# EAGLE design power (EAGLE 9.5.1)
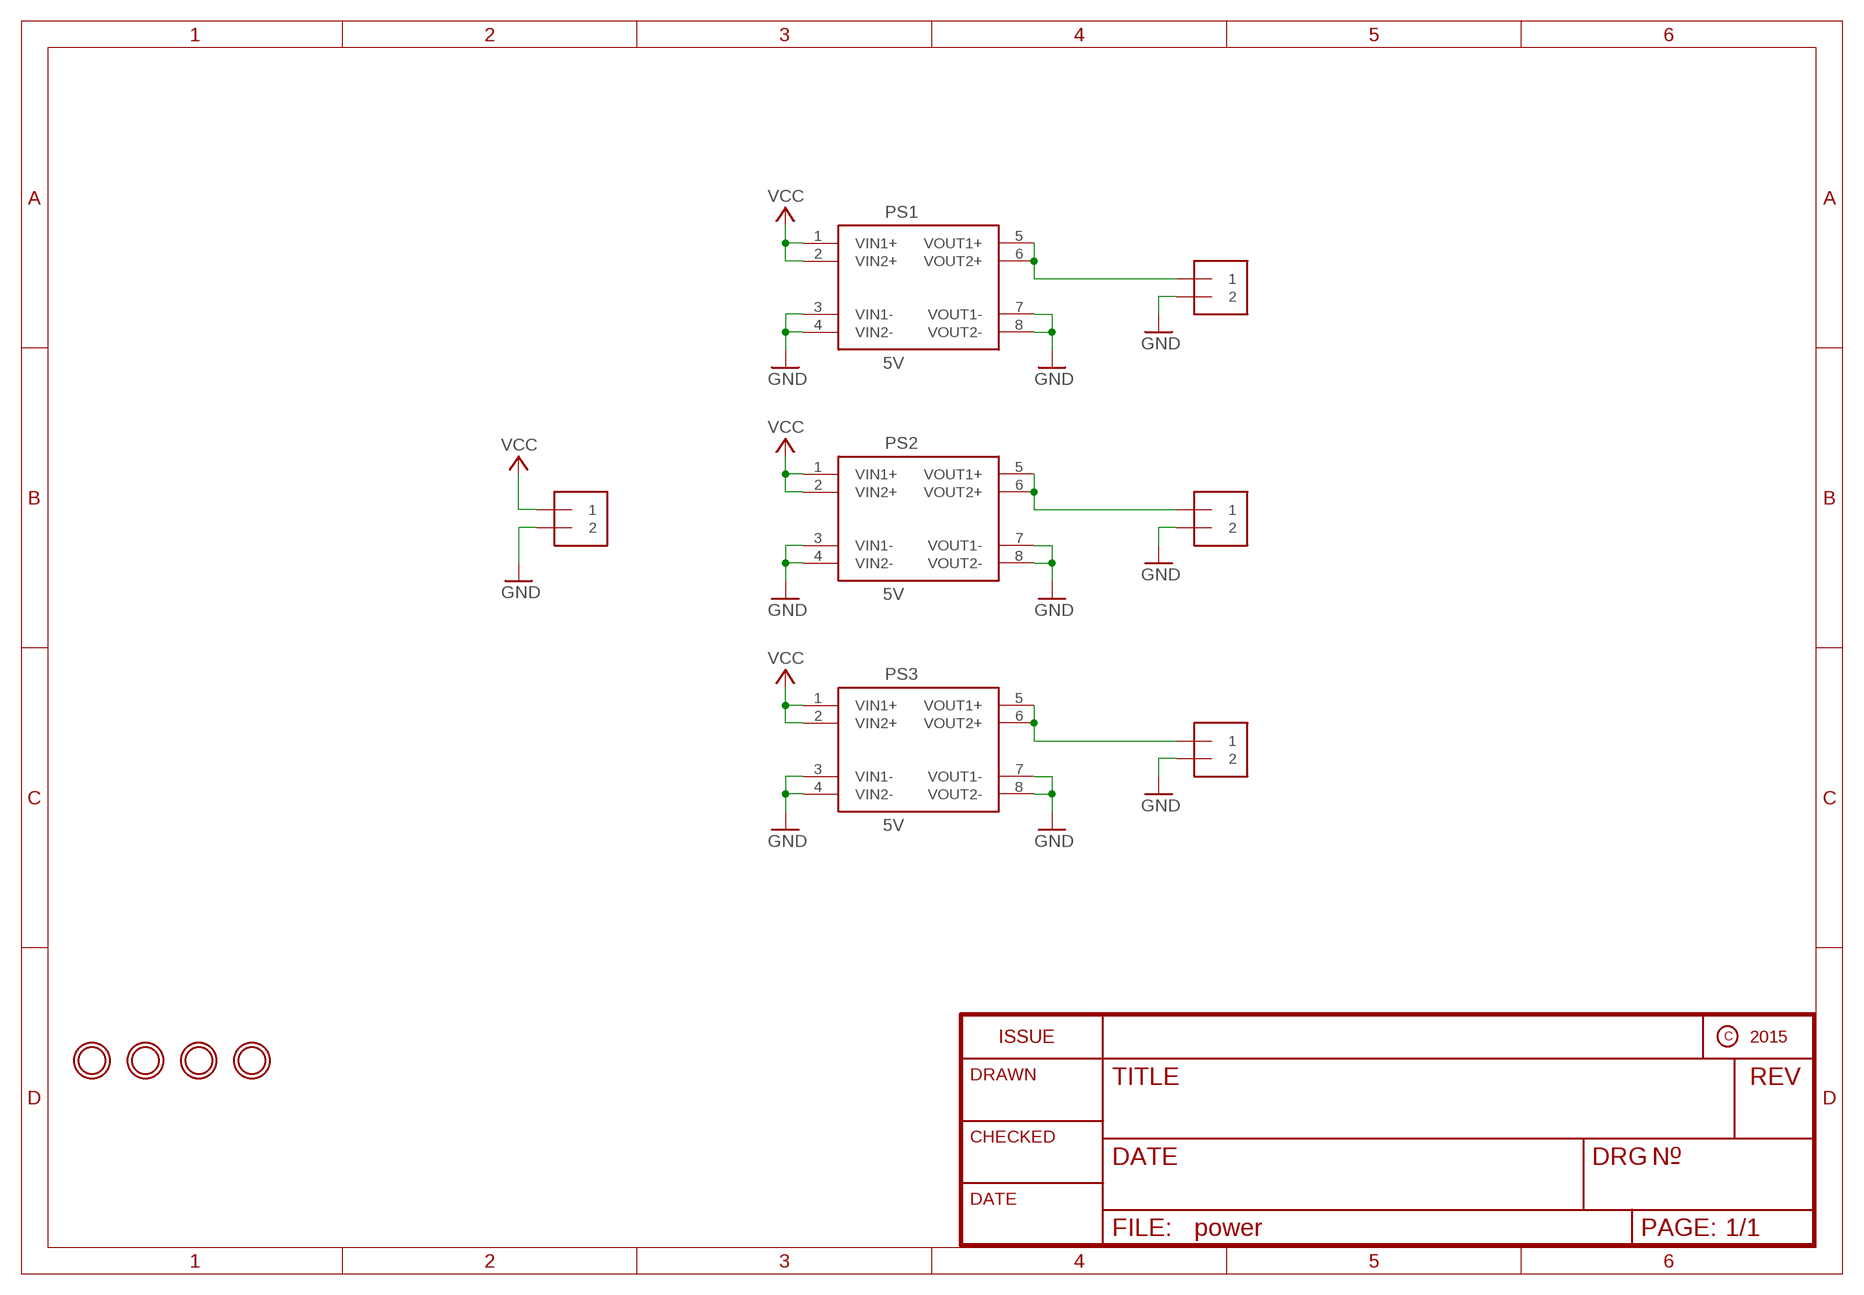
[diagram p0: schematic, sheet 1]

## Parts
J1  1X2-3.5MM  [1X2-3.5MM]
J2  1X2-3.5MM  [1X2-3.5MM]
J3  1X2-3.5MM  [1X2-3.5MM]
J4  1X2-3.5MM  [1X2-3.5MM]
PS1  5V  K8801MODULE  [K8801]
PS2  5V  K8801MODULE  [K8801]
PS3  5V  K8801MODULE  [K8801]
U$1  MICROBUILDER_MOUNTINGHOLE2.5  [MICROBUILDER_MOUNTINGHOLE_2.5_PLATED]
U$2  MICROBUILDER_MOUNTINGHOLE2.5  [MICROBUILDER_MOUNTINGHOLE_2.5_PLATED]
U$3  MICROBUILDER_MOUNTINGHOLE2.5  [MICROBUILDER_MOUNTINGHOLE_2.5_PLATED]
U$4  MICROBUILDER_MOUNTINGHOLE2.5  [MICROBUILDER_MOUNTINGHOLE_2.5_PLATED]

## Nets
GND: J1.2 J2.2 J3.2 J4.2 PS1.3(VIN1-) PS1.4(VIN2-) PS1.7(VOUT1-) PS1.8(VOUT2-) PS2.3(VIN1-) PS2.4(VIN2-) PS2.7(VOUT1-) PS2.8(VOUT2-) PS3.3(VIN1-) PS3.4(VIN2-) PS3.7(VOUT1-) PS3.8(VOUT2-)
N$3: J3.1 PS2.5(VOUT1+) PS2.6(VOUT2+)
N$5: J4.1 PS3.5(VOUT1+) PS3.6(VOUT2+)
N$7: J2.1 PS1.5(VOUT1+) PS1.6(VOUT2+)
VCC: J1.1 PS1.1(VIN1+) PS1.2(VIN2+) PS2.1(VIN1+) PS2.2(VIN2+) PS3.1(VIN1+) PS3.2(VIN2+)

## Library data of the parts
J1-J4 = adafruit:1X2: 3.5mm Terminal block http://www.ladyada.net/library/pcb/eaglelibrary.html
PS1-PS3 = sanisimov:K8801: 7V-28V to 5V DC-DC Step Down Power Supply Module Voltage Buck Converter 3A Power Supply Board Input voltage:DC 7V-28V Output valtage:DC 5V Output current:3A. max(2A for long time) Working frequency:570KHz Size:22*17.8*5mm
U$1-U$4 = Adafruit DRV8871:MICROBUILDER_MOUNTINGHOLE: Mounting Hole For #2 screws (0.086"/2.18mm width, 0.094"/2.4mm hole) use 2.5mm; BOM: EXCLUDE

## Net classes
1 GND: clearance 2.54 mm

## Board
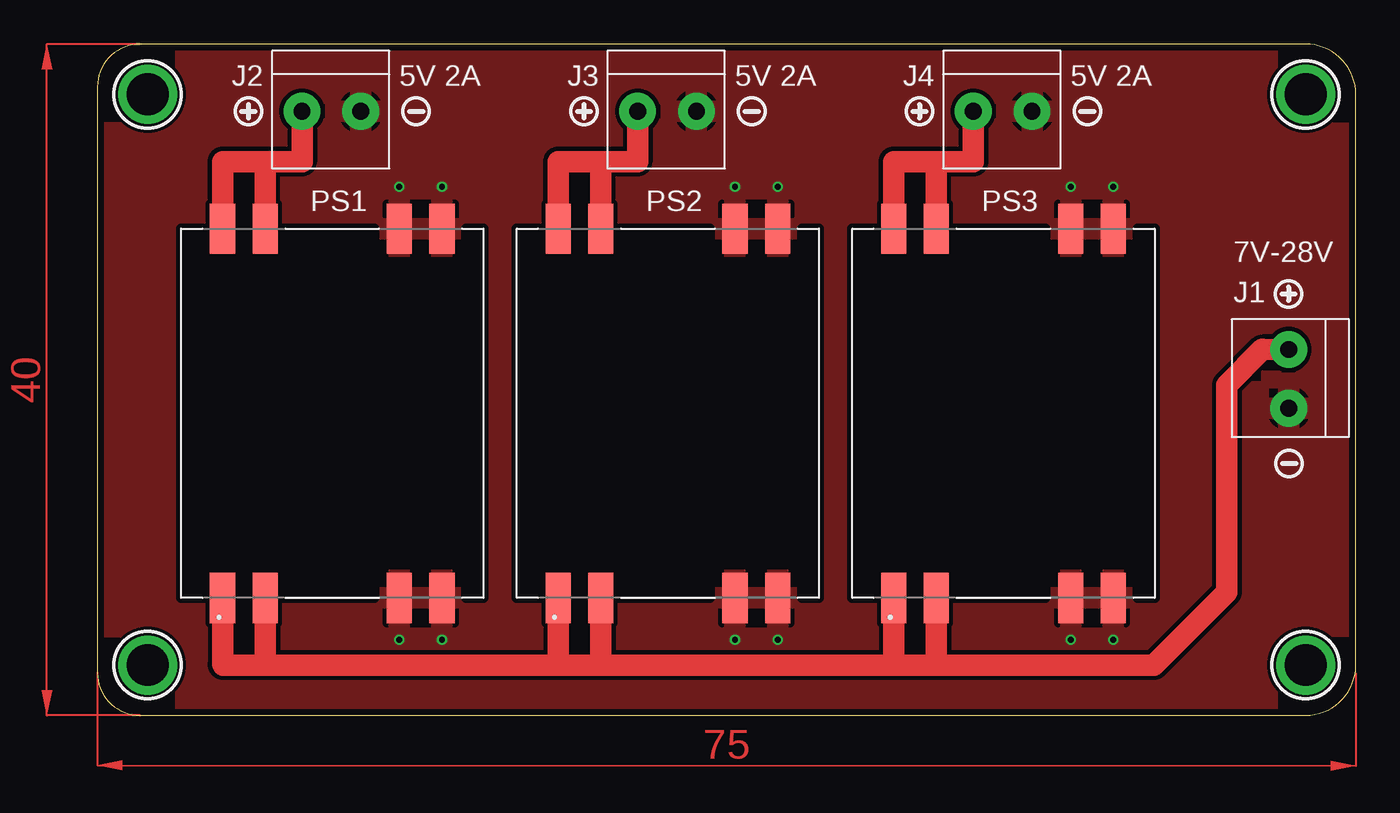
[diagram p1: board, top side]
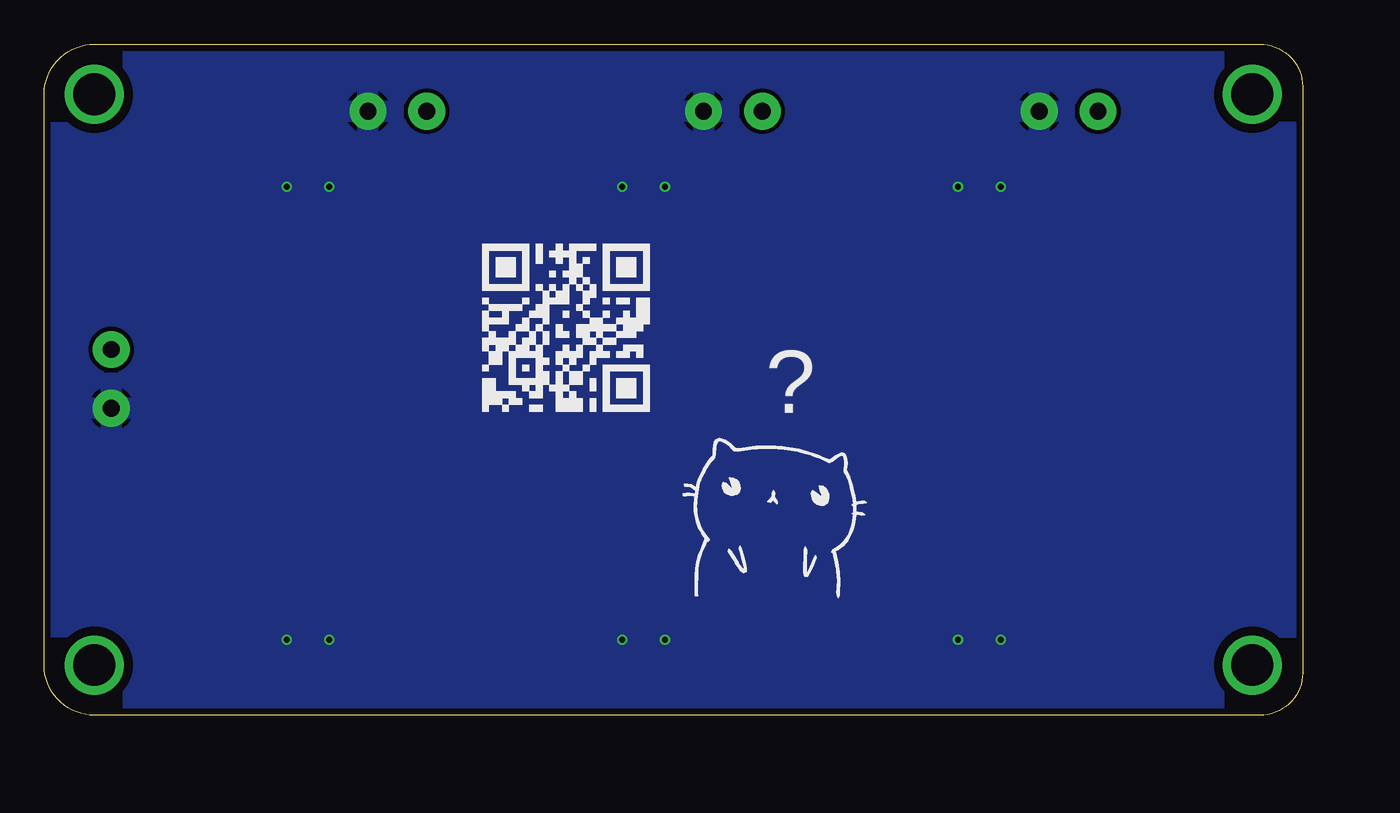
[diagram p2: board, bottom side, seen from below]

Size 75 x 40 mm. Coordinates in mm from the lower left corner, seen from the top.
Outline: 75,3 75,37 arc90 72,40 2.54,40 arc90 0,37.46 0,2.54 arc90 2.54,0 72,0 arc90 75,3
Copper layers (1*16): Top 0.035559375mm / dielectric 1.6mm / Bottom 0.035559375mm
Design rules "oshpark-2layer": minimum track width 6mil, minimum drill 10mil, track to track 6mil, track to pad 6mil, pad to pad 6mil, via to via 6mil, smd to smd 6mil, copper to edge 15mil, drill to drill 6mil, minimum pad ring 5mil, minimum via ring 5mil, stop-mask expansion 2.5mil, vias tented up to drill 0mil, thermal gap 10mil

### Footprints (pad centres in the part's own frame; a part is rotated, then mirrored left to right if it is on the bottom)
1X2-3.5MM = drill 1 pad 2.184: 1 1.8,0; 2 -1.7,0
K8801 = smd 1.5 x 3: 1 -6.54,-11; 2 -4,-11; 3 4,-11; 4 6.54,-11; 5 -6.54,11; 6 -4,11; 7 4,11; 8 6.54,11
MICROBUILDER_MOUNTINGHOLE_2.5_PLATED = drill 2.5 pad 3.2: P$1 0,0

### Placement (x,y rotation side)
J1  71,20 90 top
J2  14,36 180 top
J3  34,36 180 top
J4  54,36 180 top
PS1  14,18 0 top
PS2  34,18 0 top
PS3  54,18 0 top
U$1  3,37 0 top
U$2  3,3 0 top
U$3  72,3 0 top
U$4  72,37 0 top
U$5  [SYMBOL_PLUS]  9,36 90 top
U$6  [SYMBOL_MINUS]  19,36 180 top
U$7  [SYMBOL_PLUS]  49,36 90 top
U$8  [SYMBOL_MINUS]  59,36 180 top
U$9  [SYMBOL_PLUS]  70.99,25.12 90 top
U$10  [SYMBOL_MINUS]  71.02,15.01 180 top
U$11  [SYMBOL_PLUS]  29,36 90 top
U$12  [SYMBOL_MINUS]  39,36 180 top

### Tracks (layer width: path | path; a pad name or v marks a point on that pad's centre or on a via)
GND  (via drill 0.35)
  other vias: 38,31.5 40.54,31.5 58,31.5 60.54,31.5 18,31.5 20.54,31.5 18,4.5 20.54,4.5 38,4.5 40.54,4.5 58,4.5 60.54,4.5
  pour Bottom (isolate 0.254): -1.27,41.91 77.47,41.91 77.47,-1.27 -1.27,-1.27
  pour Top (isolate 0.254): -1.27,41.91 77.47,41.91 77.47,-1.27 -1.27,-1.27
N$3
  Top 1.27: J3.1 32.2,33 30,33 | 30,33 27.46,33 PS2.5 | PS2.6 30,33
N$5
  Top 1.27: J4.1 52.2,33 50,33 | 50,33 47.46,33 PS3.5 | PS3.6 50,33
N$7
  Top 1.27: J2.1 12.2,33 10,33 | 10,33 7.46,33 PS1.5 | PS1.6 10,33
VCC
  Top 1.27: J1.1 69.43,21.8 67.31,19.68 67.31,7.35 62.96,3 50,3 | 50,3 47.5,3 | PS3.2 50,3 | PS3.1 47.46,3.04 47.5,3 | 47.5,3 30,3 | 30,3 27.5,3 | PS2.2 30,3 | PS2.1 27.46,3.04 27.5,3 | 27.5,3 13.6,3 10,3 | 10,3 7.5,3 7.46,3.04 PS1.1 | PS1.2 10,3
(copper drawn outside any net)
  shapes: Top area x2

### Text on the board
tPlace: 5V 2A | 5V 2A | 5V 2A | 7V-28V
bPlace: ?